# Altium schematic sheet FPGA_Lattice_EC-ECP_Standard_Evaluation_Board_RevB.SchDoc
size B
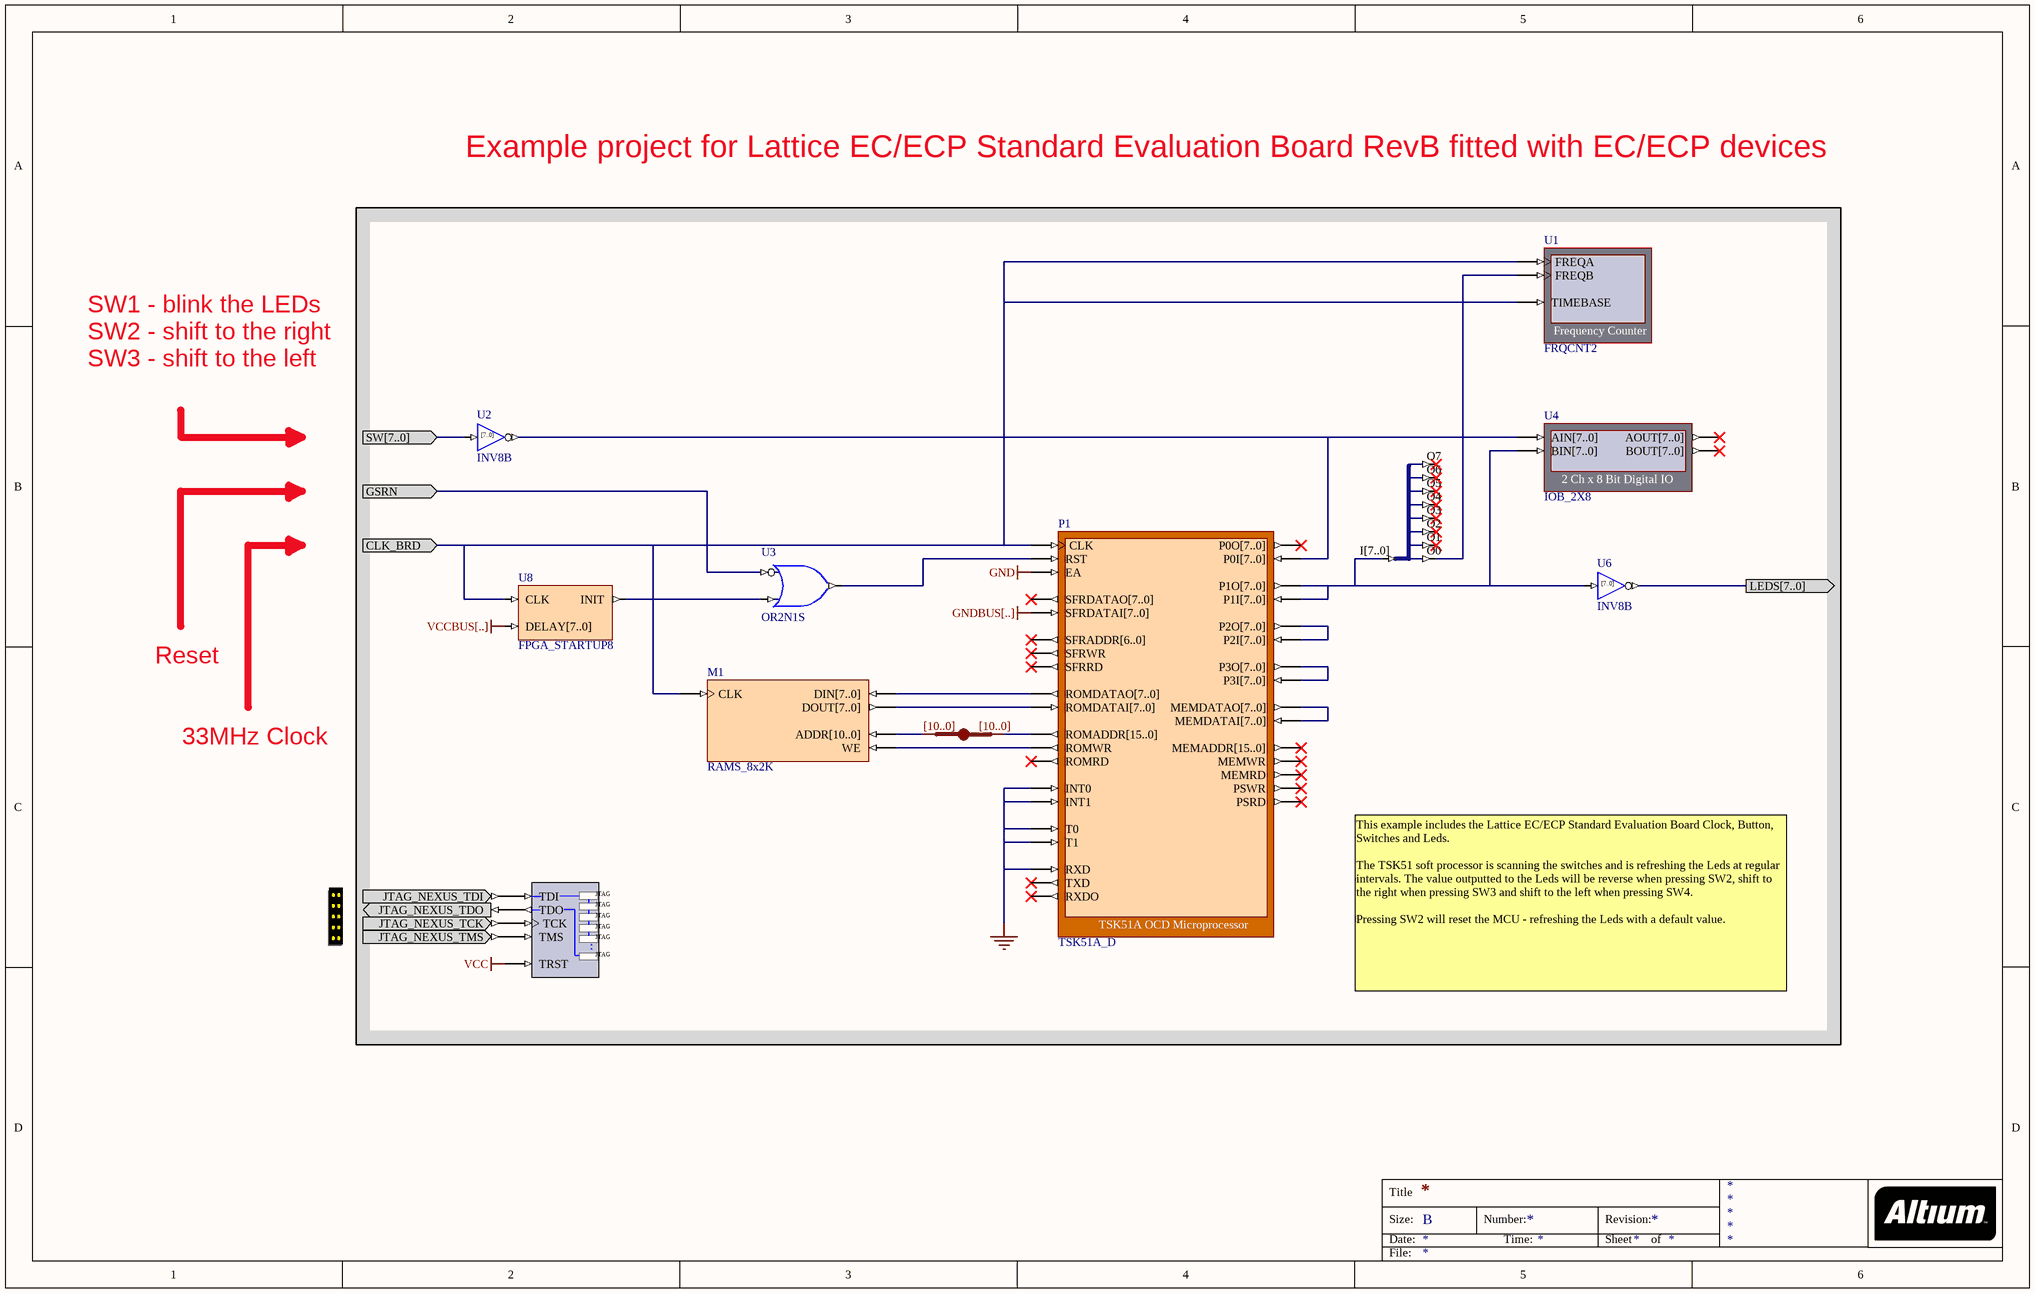
[diagram p0: FPGA_Lattice_EC-ECP_Standard_Evaluation_Board_RevB.SchDoc]

## Parts
?  NEXUS_JTAG_CONNECTOR  (value not drawn)
JB_S1  IndexA: [10..0]  (hidden comment: JB)
M1  RAMS_8x2K
NEXUS_JTAG_PORT  NEXUS_JTAG_PORT  (value not drawn)
P1  TSK51A_D
U1  FRQCNT2
U2  INV8B
U3  OR2N1S
U4  IOB_2X8
U6  INV8B
U7  J8B_8S  (value not drawn)
U8  FPGA_STARTUP8

## Ports
CLK_BRD (in), GSRN (in), LEDS[7..0] (out), SW[7..0] (in)

## Nets
GND: P1.EA P1.INT0 P1.INT1 P1.RXD P1.T0 P1.T1
GNDBUS[..]: P1.SFRDATAI[7..0]
VCC: NEXUS_JTAG_PORT.TRST
VCCBUS[..]: U8.DELAY[7..0]
CLK_BRD: M1.CLK P1.CLK U1.FREQA U1.TIMEBASE U8.CLK ; port CLK_BRD
GSRN: U3.I0 ; port GSRN
LEDS[7..0]: U6.O[7..0] ; port LEDS[7..0]
SW[7..0]: U2.I[7..0] ; port SW[7..0]
Net?_JTAG_NEXUS_TCK: ?.JTAG_NEXUS_TCK NEXUS_JTAG_PORT.TCK
Net?_JTAG_NEXUS_TDI: ?.JTAG_NEXUS_TDI NEXUS_JTAG_PORT.TDI
Net?_JTAG_NEXUS_TDO: ?.JTAG_NEXUS_TDO NEXUS_JTAG_PORT.TDO
Net?_JTAG_NEXUS_TMS: ?.JTAG_NEXUS_TMS NEXUS_JTAG_PORT.TMS
NetJB_S1_A[0..0]: JB_S1.A[0..0] M1.ADDR[10..0]
NetJB_S1_B[0..0]: JB_S1.B[0..0] P1.ROMADDR[15..0]
NetM1_DIN[7..0]: M1.DIN[7..0] P1.ROMDATAO[7..0]
NetM1_DOUT[7..0]: M1.DOUT[7..0] P1.ROMDATAI[7..0]
NetM1_WE: M1.WE P1.ROMWR
NetP1_MEMDATAI[7..0]: P1.MEMDATAI[7..0] P1.MEMDATAO[7..0]
NetP1_P0I[7..0]: P1.P0I[7..0] U2.O[7..0] U4.AIN[7..0]
NetP1_P1I[7..0]: P1.P1I[7..0] P1.P1O[7..0] U4.BIN[7..0] U6.I[7..0] U7.I[7..0]
NetP1_P2I[7..0]: P1.P2I[7..0] P1.P2O[7..0]
NetP1_P3I[7..0]: P1.P3I[7..0] P1.P3O[7..0]
NetP1_RST: P1.RST U3.O
NetU1_FREQB: U1.FREQB U7.O0
NetU3_I1: U3.I1 U8.INIT

Not connected (* = marked no-connect by the designer): P1 MEMADDR[15..0]* MEMRD* MEMWR* P0O[7..0]* PSRD* PSWR* ROMRD* RXDO* SFRADDR[6..0]* SFRDATAO[7..0]* SFRRD* SFRWR* TXD*; U4 AOUT[7..0]* BOUT[7..0]*; U7 O1* O2* O3* O4* O5* O6* O7*

## Notes on the sheet
- (near U1) Example project for Lattice EC/ECP Standard Evaluation Board RevB fitted with EC/ECP devices
- SW1 - blink the LEDs
  SW2 - shift to the right
  SW3 - shift to the left
- Reset
- 33MHz Clock
- This example includes the Lattice EC/ECP Standard Evaluation Board Clock, Button, Switches and Leds.
  The TSK51 soft processor is scanning the switches and is refreshing the Leds at regular intervals. The value outputted to the Leds will be reverse when pressing SW2, shift to the right when pressing SW3 and shift to the left when pressing SW4.
  Pressing SW2 will reset the MCU - refreshing the Leds with a default value.
- Title
- Size:
- Date:
- B
- Number:
- Time:
- Revision:
- Sheet
- of
- File:
- (in symbol INV8B) [7..0]
- (in symbol NEXUS_JTAG_PORT) .

## Library data of the parts
? = NEXUS_JTAG_CONNECTOR: JTAG Port; PortComponent: True; Published: 19-Nov-2003; Publisher: Altium Limited; HelpURL: TR0102 NanoBoard Technical Reference Manual - NB1.pdf#page=33
JB_S1 = JB: System BUS Joiner; Published: 29-Jan-2004; Publisher: Altium Limited; LastRevisionNo: 1.00.00; HelpURL: CR0118 FPGA Generic Library Guide.pdf#page=297; FunctionalClass: Bus Joiner; IndexB: [10..0]
M1 = RAMS_8x2K: Single Port RAM; Memory_Depth: 2048; Memory_Type: RAM_SinglePortBlock; Memory_Width: 8; Memory_ClockEdge: Rising; Nexus_Core: Memory_Program; Memory_EnablePin: False; Published: 11/10/2004; Publisher: Altium Hobart Technology Center; Memory_ByteWrites: False
NEXUS_JTAG_PORT = NEXUS_JTAG_PORT: Soft Nexus-Chain Connector; NEXUS_JTAG_CONNECTOR: True; FunctionalClass: JTAG; Published: 29-Jan-2004; Publisher: Altium Limited; LastRevisionNo: 1.00.00; HelpURL: CR0118 FPGA Generic Library Guide.pdf#page=405
P1 = TSK51A_D: TSK51A OCD Microprocessor; NEXUS_CORE: Processor_OCDS; NEXUS_JTAG_DEVICE: True; NEXUS_JTAG_ORDER: 0; ChildModel1: RAM256x8_TSK51D; ChildCore1: M1; ChildModel2: RAM256x8_TSK51D_prim0; Published: 17-Nov-2004; Publisher: Altium Limited; ComponentLink1Description: Core &Resource Usage; ComponentLink1URL: CR0140 FPGA Processor Resource Usage.pdf#page=7; HelpURL: CR0115 TSK51x MCU.pdf; LastRevisionNo: 1.00.00; ComponentLink2Description: Embedded &Tools Guide; ComponentLink2URL: GU0107 Using the TSK51x TSK52x Embedded Tools.pdf; ComponentLink3Description: Embedded T&echnical References; ComponentLink3URL: TR0105 TSK51x TSK52x Embedded Tools Reference.pdf
U1 = FRQCNT2: Frequency Counter; NEXUS_CORE: Instrument; NEXUS_JTAG_DEVICE: True; NEXUS_JTAG_ORDER: 0; Published: 3-Nov-2004; Publisher: Altium Limited; Core Revision: 1.00.00; ComponentLink1Description: Core &Resource Usage; ComponentLink1URL: CR0134 FPGA Instrument Resource Usage.pdf#page=3; HelpURL: CR0101 FRQCNT2 Frequency Counter.pdf; LastRevisionNo: 1.00.00
U2 U6 = INV8B: 8-Bit Inverter, Bus Version; XilinxEquivalent: INV8; FunctionalClass: Logic Primitive; SubClass: INV; PortSize: 8; ArchiveName: GENERIC; VHDLIB_SIM: GENERIC_LIB; Published: 29-Jan-2004; Publisher: Altium Limited; LastRevisionNo: 1.00.00; HelpURL: CR0118 FPGA Generic Library Guide.pdf#page=291; ComponentLink1URL: CR0136 FPGA Logic Primitive Resource Usage.pdf#page=74; ComponentLink1Description: Core &Resource Usage; PortStyle: Bus Version
U3 = OR2N1S: 2-Input OR Gate with Active Low A Input, Single Pin Version; XilinxEquivalent: OR2B1; FunctionalClass: Logic Primitive; PortSize: 2; ArchiveName: GENERIC; VHDLIB_SIM: GENERIC_LIB; Published: 29-Jan-2004; Publisher: Altium Limited; LastRevisionNo: 1.00.00; HelpURL: CR0118 FPGA Generic Library Guide.pdf#page=410; ComponentLink1URL: CR0136 FPGA Logic Primitive Resource Usage.pdf#page=187; ComponentLink1Description: Core &Resource Usage; SubClass: OR; PortStyle: Single Pin Version
U4 = IOB_2X8: 2 Ch x 8 Bit Digital IO; NEXUS_CORE: Instrument; NEXUS_JTAG_DEVICE: True; NEXUS_JTAG_ORDER: 0; Published: 3-Nov-2004; Publisher: Altium Limited; Core Revision: 1.00.00; ComponentLink1Description: Core &Resource Usage; ComponentLink1URL: CR0134 FPGA Instrument Resource Usage.pdf#page=6; HelpURL: CR0102 IOB_x Digital IO Module.pdf; LastRevisionNo: 1.00.00
U7 = J8B_8S: 8-Bit input bus to 8 single pin outputs; FunctionalClass: Bus Joiner; PortSize: 8; ArchiveName: GENERIC; VHDLIB_SIM: GENERIC_LIB; Published: 29-Jan-2004; Publisher: Altium Limited; LastRevisionNo: 1.00.00; HelpURL: CR0118 FPGA Generic Library Guide.pdf#page=304; ComponentLink1URL: CR0126 FPGA Bus Joiner Resource Usage.pdf#page=27; ComponentLink1Description: Core &Resource Usage
U8 = FPGA_STARTUP8: FPGA Startup With 8 Bit Delay; Published: 9-Dec-2004; Publisher: Altium Limited; HelpURL: CR0119 FPGA_STARTUPx Powerup Delay Unit.pdf; LastRevisionNo: 1.00.00; ComponentLink1Description: Core &Resource Usage; ComponentLink1URL: CR0139 FPGA Peripheral Resource Usage.pdf#page=10